# EAGLE schematic back (EAGLE 6.5.0)
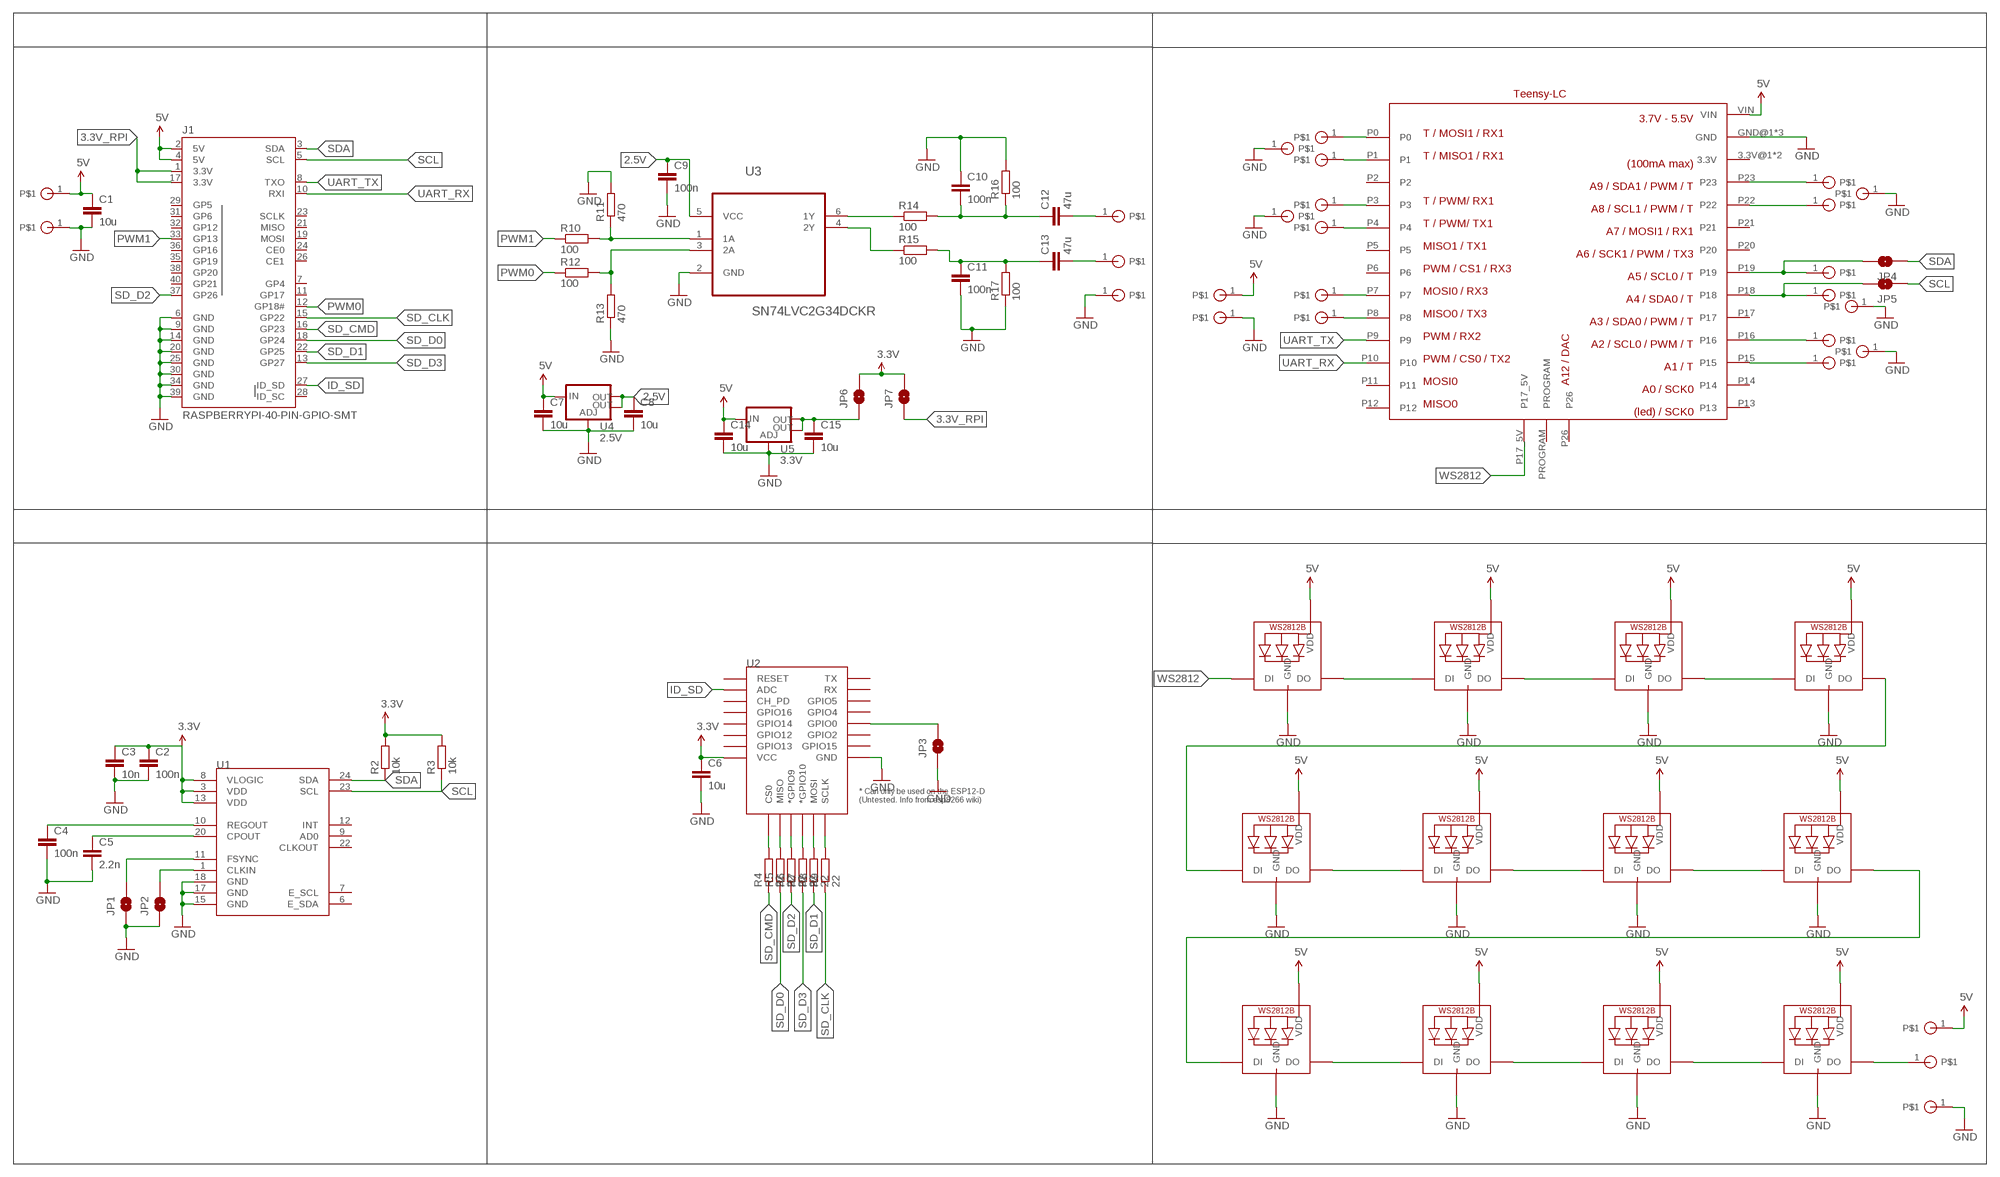
[diagram p0: schematic, sheet 1]

## Parts
5V_FRONT  SOLDER_PAD  [SOLDER_PAD]
5V_POWER  SOLDER_PAD  [SOLDER_PAD]
5V_WS1282  SOLDER_PAD  [SOLDER_PAD]
AUDIO_GND  SOLDER_PAD  [SOLDER_PAD]
AUDIO_L  SOLDER_PAD  [SOLDER_PAD]
AUDIO_R  SOLDER_PAD  [SOLDER_PAD]
C1  10u  C-EUC0805  [C0805]
C2  100n  C-EUC0603  [C0603]
C3  10n  C-EUC0603  [C0603]
C4  100n  C-EUC0603  [C0603]
C5  2.2n  C-EUC0603  [C0603]
C6  10u  C-EUC0805  [C0805]
C7  10u  C-EUC0805  [C0805]
C8  10u  C-EUC0805  [C0805]
C9  100n  C-EUC0603  [C0603]
C10  100n  C-EUC0603  [C0603]
C11  100n  C-EUC0603  [C0603]
C12  47u  C-EUC0805  [C0805]
C13  47u  C-EUC0805  [C0805]
C14  10u  C-EUC0805  [C0805]
C15  10u  C-EUC0805  [C0805]
DO_WS1282  SOLDER_PAD  [SOLDER_PAD]
GND_FRONT  SOLDER_PAD  [SOLDER_PAD]
GND_POWER  SOLDER_PAD  [SOLDER_PAD]
GND_T1_T2  SOLDER_PAD  [SOLDER_PAD]
GND_T3_T4  SOLDER_PAD  [SOLDER_PAD]
GND_T5_T6  SOLDER_PAD  [SOLDER_PAD]
GND_T7_T8  SOLDER_PAD  [SOLDER_PAD]
GND_T_SPARE  SOLDER_PAD  [SOLDER_PAD]
GND_WS2812  SOLDER_PAD  [SOLDER_PAD]
J1  RASPBERRYPI-40-PIN-GPIO-SMT  [2X20-SHROUDED-SMT]
JP1  JUMPER-PAD-2-NOYES_SILK  [PAD-JUMPER-2-NO_YES_SILK]
JP2  JUMPER-PAD-2-NOYES_SILK  [PAD-JUMPER-2-NO_YES_SILK]
JP3  JUMPER-PAD-2-NOYES_SILK  [PAD-JUMPER-2-NO_YES_SILK]
JP4  JUMPER-PAD-2-NOYES_SILK  [PAD-JUMPER-2-NO_YES_SILK]
JP5  JUMPER-PAD-2-NOYES_SILK  [PAD-JUMPER-2-NO_YES_SILK]
JP6  JUMPER-PAD-2-NOYES_SILK  [PAD-JUMPER-2-NO_YES_SILK]
JP7  JUMPER-PAD-2-NOYES_SILK  [PAD-JUMPER-2-NO_YES_SILK]
LED1  WS2812B5050  [WS2812B]
LED2  WS2812B5050  [WS2812B]
LED3  WS2812B5050  [WS2812B]
LED4  WS2812B5050  [WS2812B]
LED5  WS2812B5050  [WS2812B]
LED6  WS2812B5050  [WS2812B]
LED7  WS2812B5050  [WS2812B]
LED8  WS2812B5050  [WS2812B]
LED9  WS2812B5050  [WS2812B]
LED10  WS2812B5050  [WS2812B]
LED11  WS2812B5050  [WS2812B]
LED12  WS2812B5050  [WS2812B]
R2  10k  R-EU_R0603  [R0603]
R3  10k  R-EU_R0603  [R0603]
R4  22  R-EU_R0603  [R0603]
R5  22  R-EU_R0603  [R0603]
R6  22  R-EU_R0603  [R0603]
R7  22  R-EU_R0603  [R0603]
R8  22  R-EU_R0603  [R0603]
R9  22  R-EU_R0603  [R0603]
R10  100  R-EU_R0603  [R0603]
R11  470  R-EU_R0603  [R0603]
R12  100  R-EU_R0603  [R0603]
R13  470  R-EU_R0603  [R0603]
R14  100  R-EU_R0603  [R0603]
R15  100  R-EU_R0603  [R0603]
R16  100  R-EU_R0603  [R0603]
R17  100  R-EU_R0603  [R0603]
RX3  SOLDER_PAD  [SOLDER_PAD]
SCL/TOUCH  SOLDER_PAD  [SOLDER_PAD]
SDA/TOUCH  SOLDER_PAD  [SOLDER_PAD]
TOUCH1  SOLDER_PAD  [SOLDER_PAD]
TOUCH2  SOLDER_PAD  [SOLDER_PAD]
TOUCH3  SOLDER_PAD  [SOLDER_PAD]
TOUCH4  SOLDER_PAD  [SOLDER_PAD]
TOUCH5  SOLDER_PAD  [SOLDER_PAD]
TOUCH6  SOLDER_PAD  [SOLDER_PAD]
TOUCH7  SOLDER_PAD  [SOLDER_PAD]
TOUCH8  SOLDER_PAD  [SOLDER_PAD]
TX3  SOLDER_PAD  [SOLDER_PAD]
U1  MPU-9150QFN-24-NP  [QFN-24-NP]
U2  ESP12ESMD  [ESP12E-SMD]
U3  SN74LVC2G34DCKR  [SOT65P210X110-6N]
U4  2.5V  V_REG_LM1117SOT223  [SOT223]
U5  3.3V  V_REG_LM1117SOT223  [SOT223]
U$4  TEENSY_LCSMD  [TEENSY_LC_SMD]

## Nets
2.5V: C8.1 C9.1 U3.5(VCC) U4.2(OUT) U4.4(OUT)
3.3V: C2.1 C3.1 C6.1 JP6.2 JP7.2 R2.2 R3.2 U1.3(VDD) U1.8(VLOGIC) U1.13(VDD) U2.VCC
3.3V_RPI: J1.1(3.3V) J1.17(3.3V) JP7.1
5V: 5V_FRONT.1 5V_POWER.1 5V_WS1282.1 C1.1 C7.1 C14.1 J1.2(5V) J1.4(5V) LED1.1-VDD(VDD) LED2.1-VDD(VDD) LED3.1-VDD(VDD) LED4.1-VDD(VDD) LED5.1-VDD(VDD) LED6.1-VDD(VDD) LED7.1-VDD(VDD) LED8.1-VDD(VDD) LED9.1-VDD(VDD) LED10.1-VDD(VDD) LED11.1-VDD(VDD) LED12.1-VDD(VDD) U4.3(IN) U5.3(IN) U$4.VIN
GND: AUDIO_GND.1 C1.2 C2.2 C3.2 C4.2 C5.2 C6.2 C7.2 C8.2 C9.2 C10.1 C11.2 C14.2 C15.2 GND_FRONT.1 GND_POWER.1 GND_T1_T2.1 GND_T3_T4.1 GND_T5_T6.1 GND_T7_T8.1 GND_T_SPARE.1 GND_WS2812.1 J1.6(GND) J1.9(GND) J1.14(GND) J1.20(GND) J1.25(GND) J1.30(GND) J1.34(GND) J1.39(GND) JP1.1 JP2.1 JP3.1 LED1.3-GND(GND) LED2.3-GND(GND) LED3.3-GND(GND) LED4.3-GND(GND) LED5.3-GND(GND) LED6.3-GND(GND) LED7.3-GND(GND) LED8.3-GND(GND) LED9.3-GND(GND) LED10.3-GND(GND) LED11.3-GND(GND) LED12.3-GND(GND) R11.2 R13.1 R16.2 R17.1 U1.15(GND) U1.17(GND) U1.18(GND) U2.GND U3.2(GND) U4.1(ADJ) U5.1(ADJ) U$4.GND@1(GND) U$4.GND@2(GND) U$4.GND@3(GND)
ID_SD: J1.27(ID_SD) U2.ADC
N$1: JP2.2 U1.1(CLKIN)
N$2: JP1.2 U1.11(FSYNC)
N$3: C5.1 U1.20(CPOUT)
N$4: C4.1 U1.10(REGOUT)
N$5: R14.1 U3.6(1Y)
N$6: R4.2 U2.CS0
N$7: R5.2 U2.MISO
N$8: R6.2 U2.GPIO9(*GPIO9)
N$9: R7.2 U2.GPIO10(*GPIO10)
N$10: R8.2 U2.MOSI
N$11: R9.2 U2.SCLK
N$12: JP3.2 U2.GPIO0
N$13: R10.2 R11.1 U3.1(1A)
N$14: R12.2 R13.2 U3.3(2A)
N$15: R15.1 U3.4(2Y)
N$16: C10.2 C12.1 R14.2 R16.1
N$17: C11.1 C13.1 R15.2 R17.2
N$18: LED1.2-DOUT(DO) LED2.4-DIN(DI)
N$19: AUDIO_L.1 C12.2
N$20: AUDIO_R.1 C13.2
N$21: TOUCH1.1 U$4.P0
N$22: TOUCH2.1 U$4.P1
N$23: TOUCH3.1 U$4.P3
N$24: TOUCH4.1 U$4.P4
N$25: TOUCH5.1 U$4.P23
N$26: TOUCH6.1 U$4.P22
N$27: JP4.2 SDA/TOUCH.1 U$4.P19
N$28: JP5.2 SCL/TOUCH.1 U$4.P18
N$29: TOUCH7.1 U$4.P16
N$30: TOUCH8.1 U$4.P15
N$31: RX3.1 U$4.P7
N$32: TX3.1 U$4.P8
N$33: LED2.2-DOUT(DO) LED3.4-DIN(DI)
N$34: LED3.2-DOUT(DO) LED4.4-DIN(DI)
N$35: LED4.2-DOUT(DO) LED5.4-DIN(DI)
N$36: LED5.2-DOUT(DO) LED6.4-DIN(DI)
N$37: LED6.2-DOUT(DO) LED7.4-DIN(DI)
N$38: LED7.2-DOUT(DO) LED8.4-DIN(DI)
N$39: LED8.2-DOUT(DO) LED9.4-DIN(DI)
N$40: LED9.2-DOUT(DO) LED10.4-DIN(DI)
N$41: LED10.2-DOUT(DO) LED11.4-DIN(DI)
N$42: LED11.2-DOUT(DO) LED12.4-DIN(DI)
N$43: DO_WS1282.1 LED12.2-DOUT(DO)
N$44: C15.1 JP6.1 U5.2(OUT) U5.4(OUT)
PWM0: J1.12(GP18#) R12.1
PWM1: J1.33(GP13) R10.1
SCL: J1.5(SCL) JP5.1 R3.1 U1.23(SCL)
SD_CLK: J1.15(GP22) R9.1
SD_CMD: J1.16(GP23) R4.1
SD_D0: J1.18(GP24) R5.1
SD_D1: J1.22(GP25) R8.1
SD_D2: J1.37(GP26) R6.1
SD_D3: J1.13(GP27) R7.1
SDA: J1.3(SDA) JP4.1 R2.1 U1.24(SDA)
UART_RX: J1.10(RXI) U$4.P10
UART_TX: J1.8(TXO) U$4.P9
WS2812: LED1.4-DIN(DI) U$4.P17_5V
Unconnected: J1.7(GP4) J1.11(GP17) J1.19(MOSI) J1.21(MISO) J1.23(SCLK) J1.24(CE0) J1.26(CE1) J1.28(ID_SC) J1.29(GP5) J1.31(GP6) J1.32(GP12) J1.35(GP19) J1.36(GP16) J1.38(GP20) J1.40(GP21) U1.6(E_SDA) U1.7(E_SCL) U1.9(AD0) U1.12(INT) U1.22(CLKOUT) U2.CH_PD U2.GPIO2 U2.GPIO4 U2.GPIO5 U2.GPIO12 U2.GPIO13 U2.GPIO14 U2.GPIO15 U2.GPIO16 U2.RESET U2.RXD0(RX) U2.TXD0(TX) U$4.3.3V@1(3.3V) U$4.3.3V@2(3.3V) U$4.P2 U$4.P5 U$4.P6 U$4.P11 U$4.P12 U$4.P13 U$4.P14 U$4.P17 U$4.P20 U$4.P21 U$4.P26 U$4.PROGRAM

## Library data of the parts
5V_FRONT 5V_POWER 5V_WS1282 AUDIO_GND AUDIO_L AUDIO_R DO_WS1282 GND_FRONT GND_POWER GND_T1_T2 GND_T3_T4 GND_T5_T6 GND_T7_T8 GND_T_SPARE GND_WS2812 RX3 SCL/TOUCH SDA/TOUCH TOUCH1-TOUCH8 TX3 = timearc:SOLDER_PAD
C1-C15 = timearc:C-EU: CAPACITOR, European symbol
J1 = SparkFun-Boards:RASPBERRYPI-40-PIN-GPIO: Second Generation Raspberry Pi GPIO Header 2x20 pin connector, as found on B, B+, A+ models.; PROD_ID: CONN-13143
JP1-JP7 = SparkFun-Passives:JUMPER-PAD-2-NO
LED1-LED12 = timearc:WS2812B
R2-R17 = timearc:R-EU_: RESISTOR, European symbol
U1 = timearc:MPU-9150: 9DOF (3mag, 3accel, 3rotat). I2C interface.
U2 = timearc:ESP12E: ESP12E Module
U3 = timearc:SN74LVC2G34DCKR: DUAL BUFFER GATE; MPN: SN74LVC2G34DCKR; OC_FARNELL: 1595409; OC_NEWARK: 76C4214; PACKAGE: SC70-6; SUPPLIER: Texas Instruments
U4 U5 = SparkFun-PowerIC:V_REG_LM1117: Voltage Regulator LM1117 Standard adjustable voltage regulator but in SMD form. Spark Fun Electronics SKU : COM-00595; PROD_ID: VREG-08170
U$4 = timearc:TEENSY_LC: Teensy LC